# EAGLE schematic v1 (EAGLE 7.7.0)
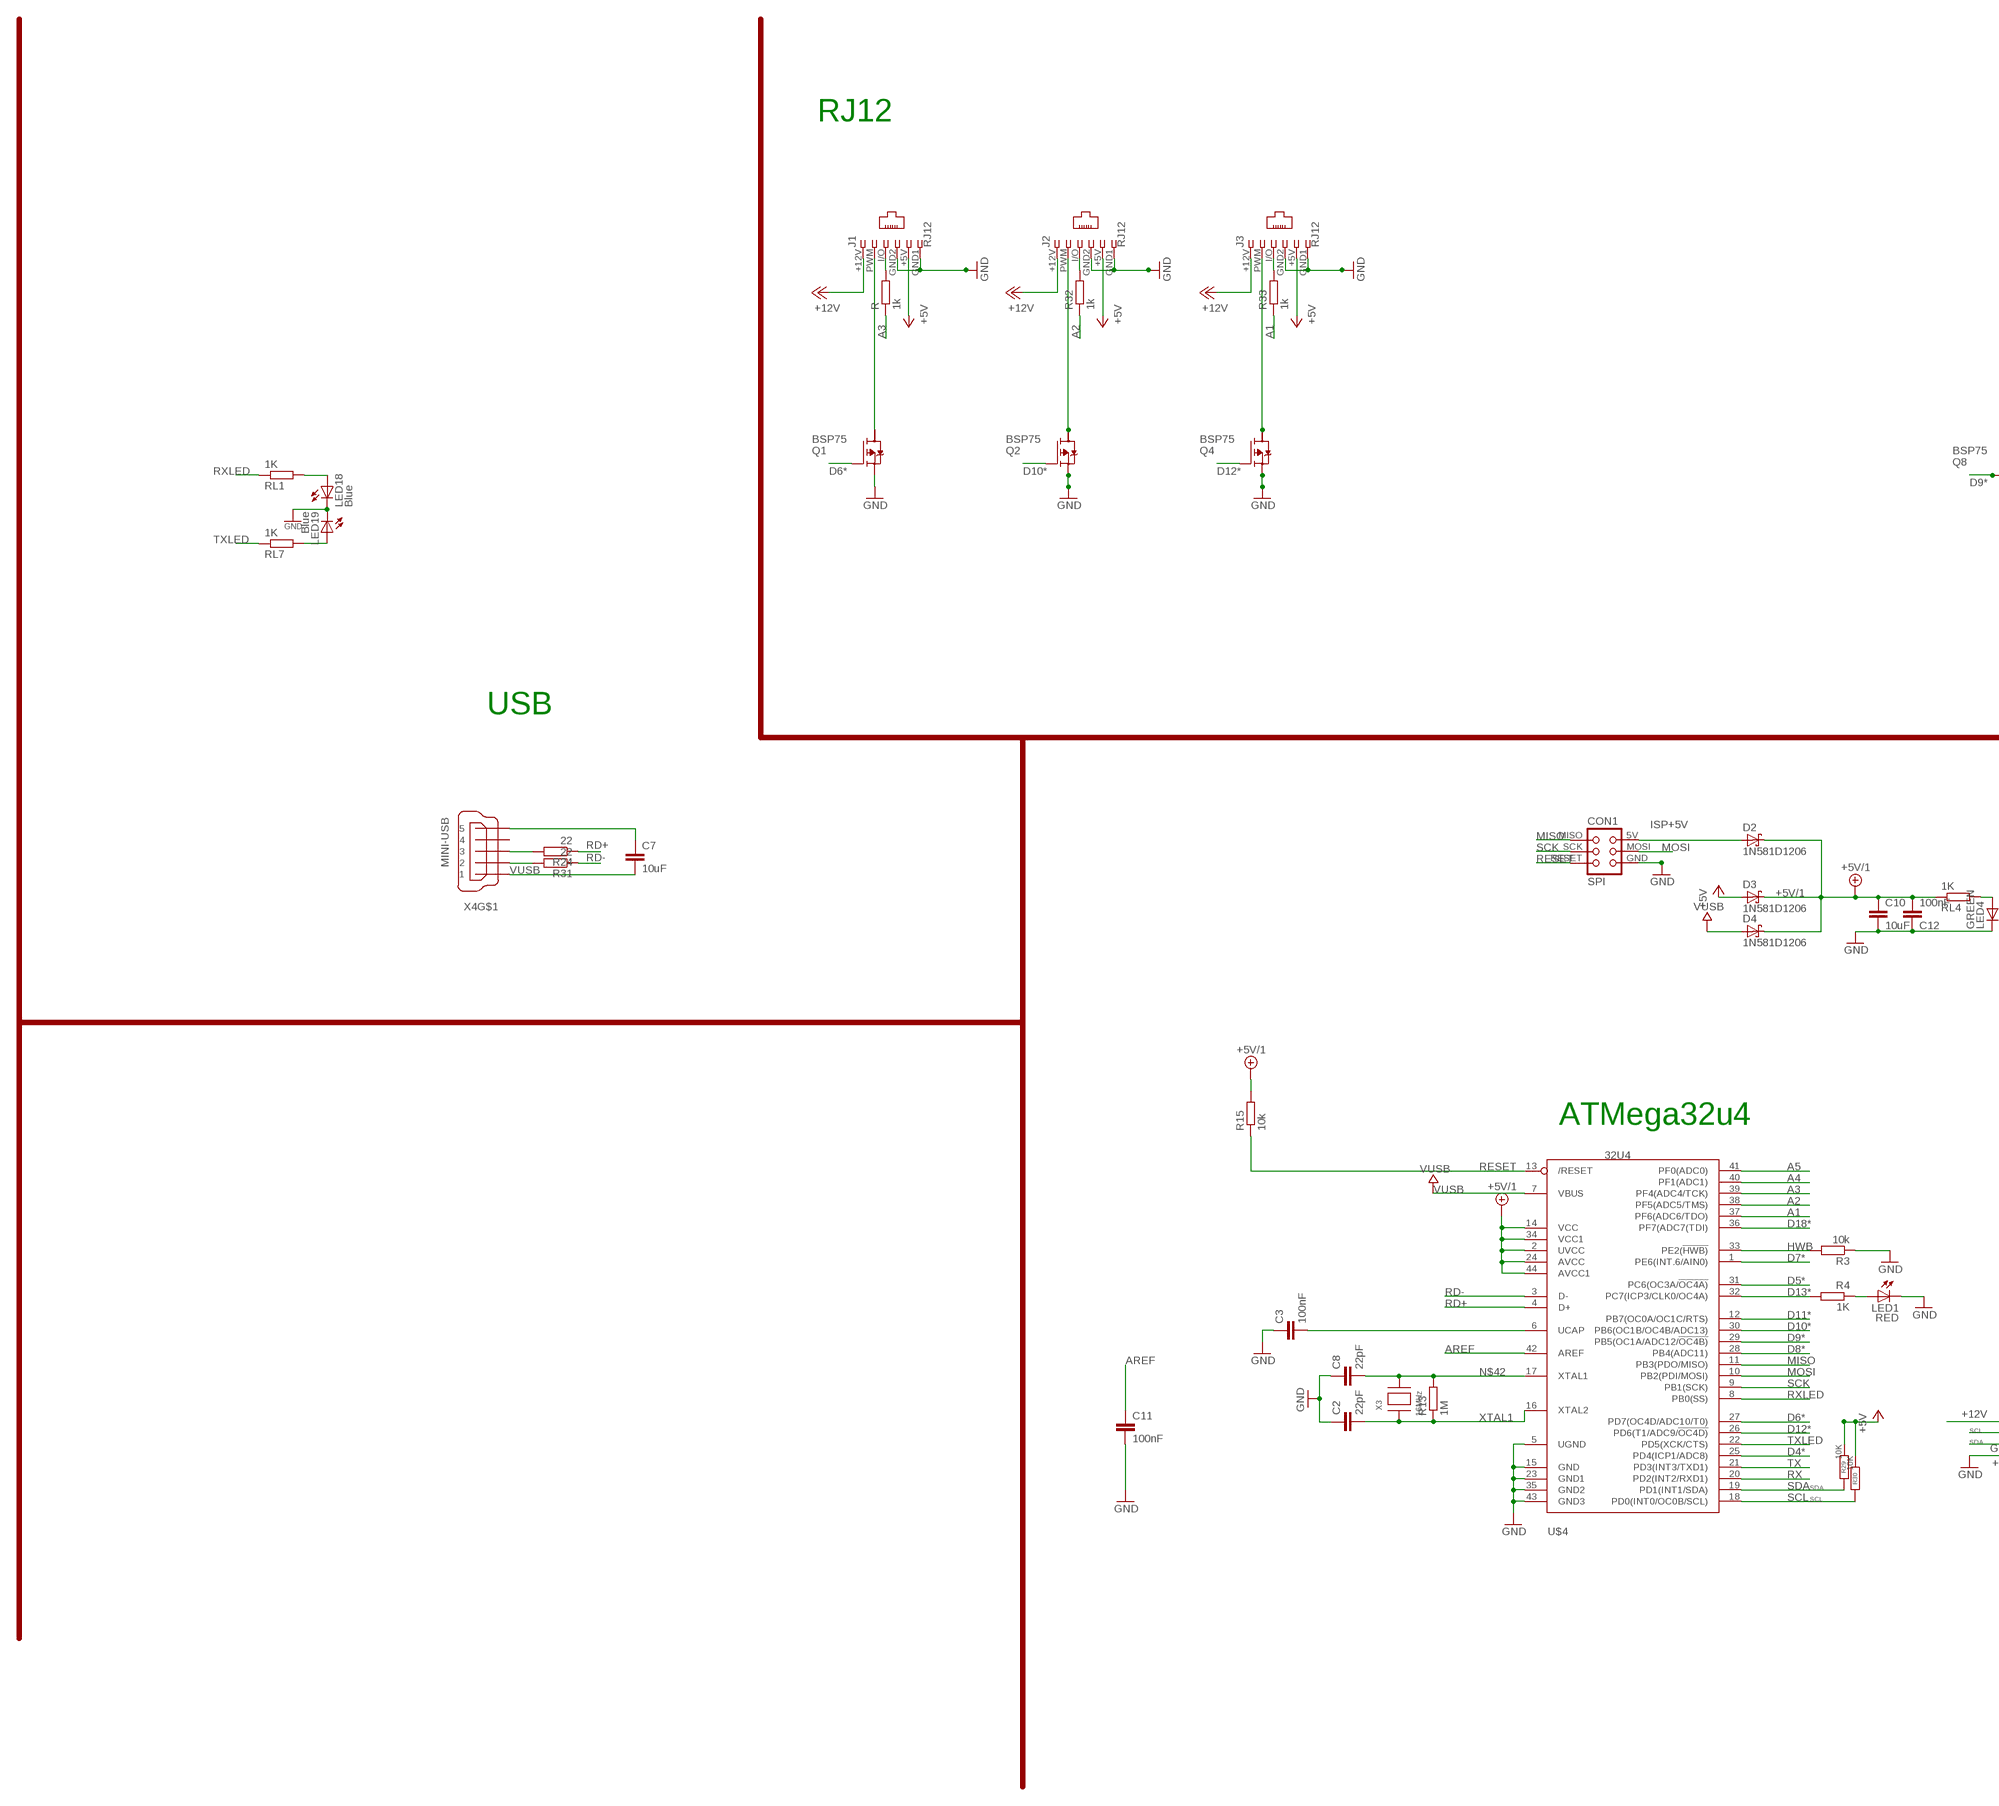
[diagram p0: schematic, sheet 1, part 1 of 2]
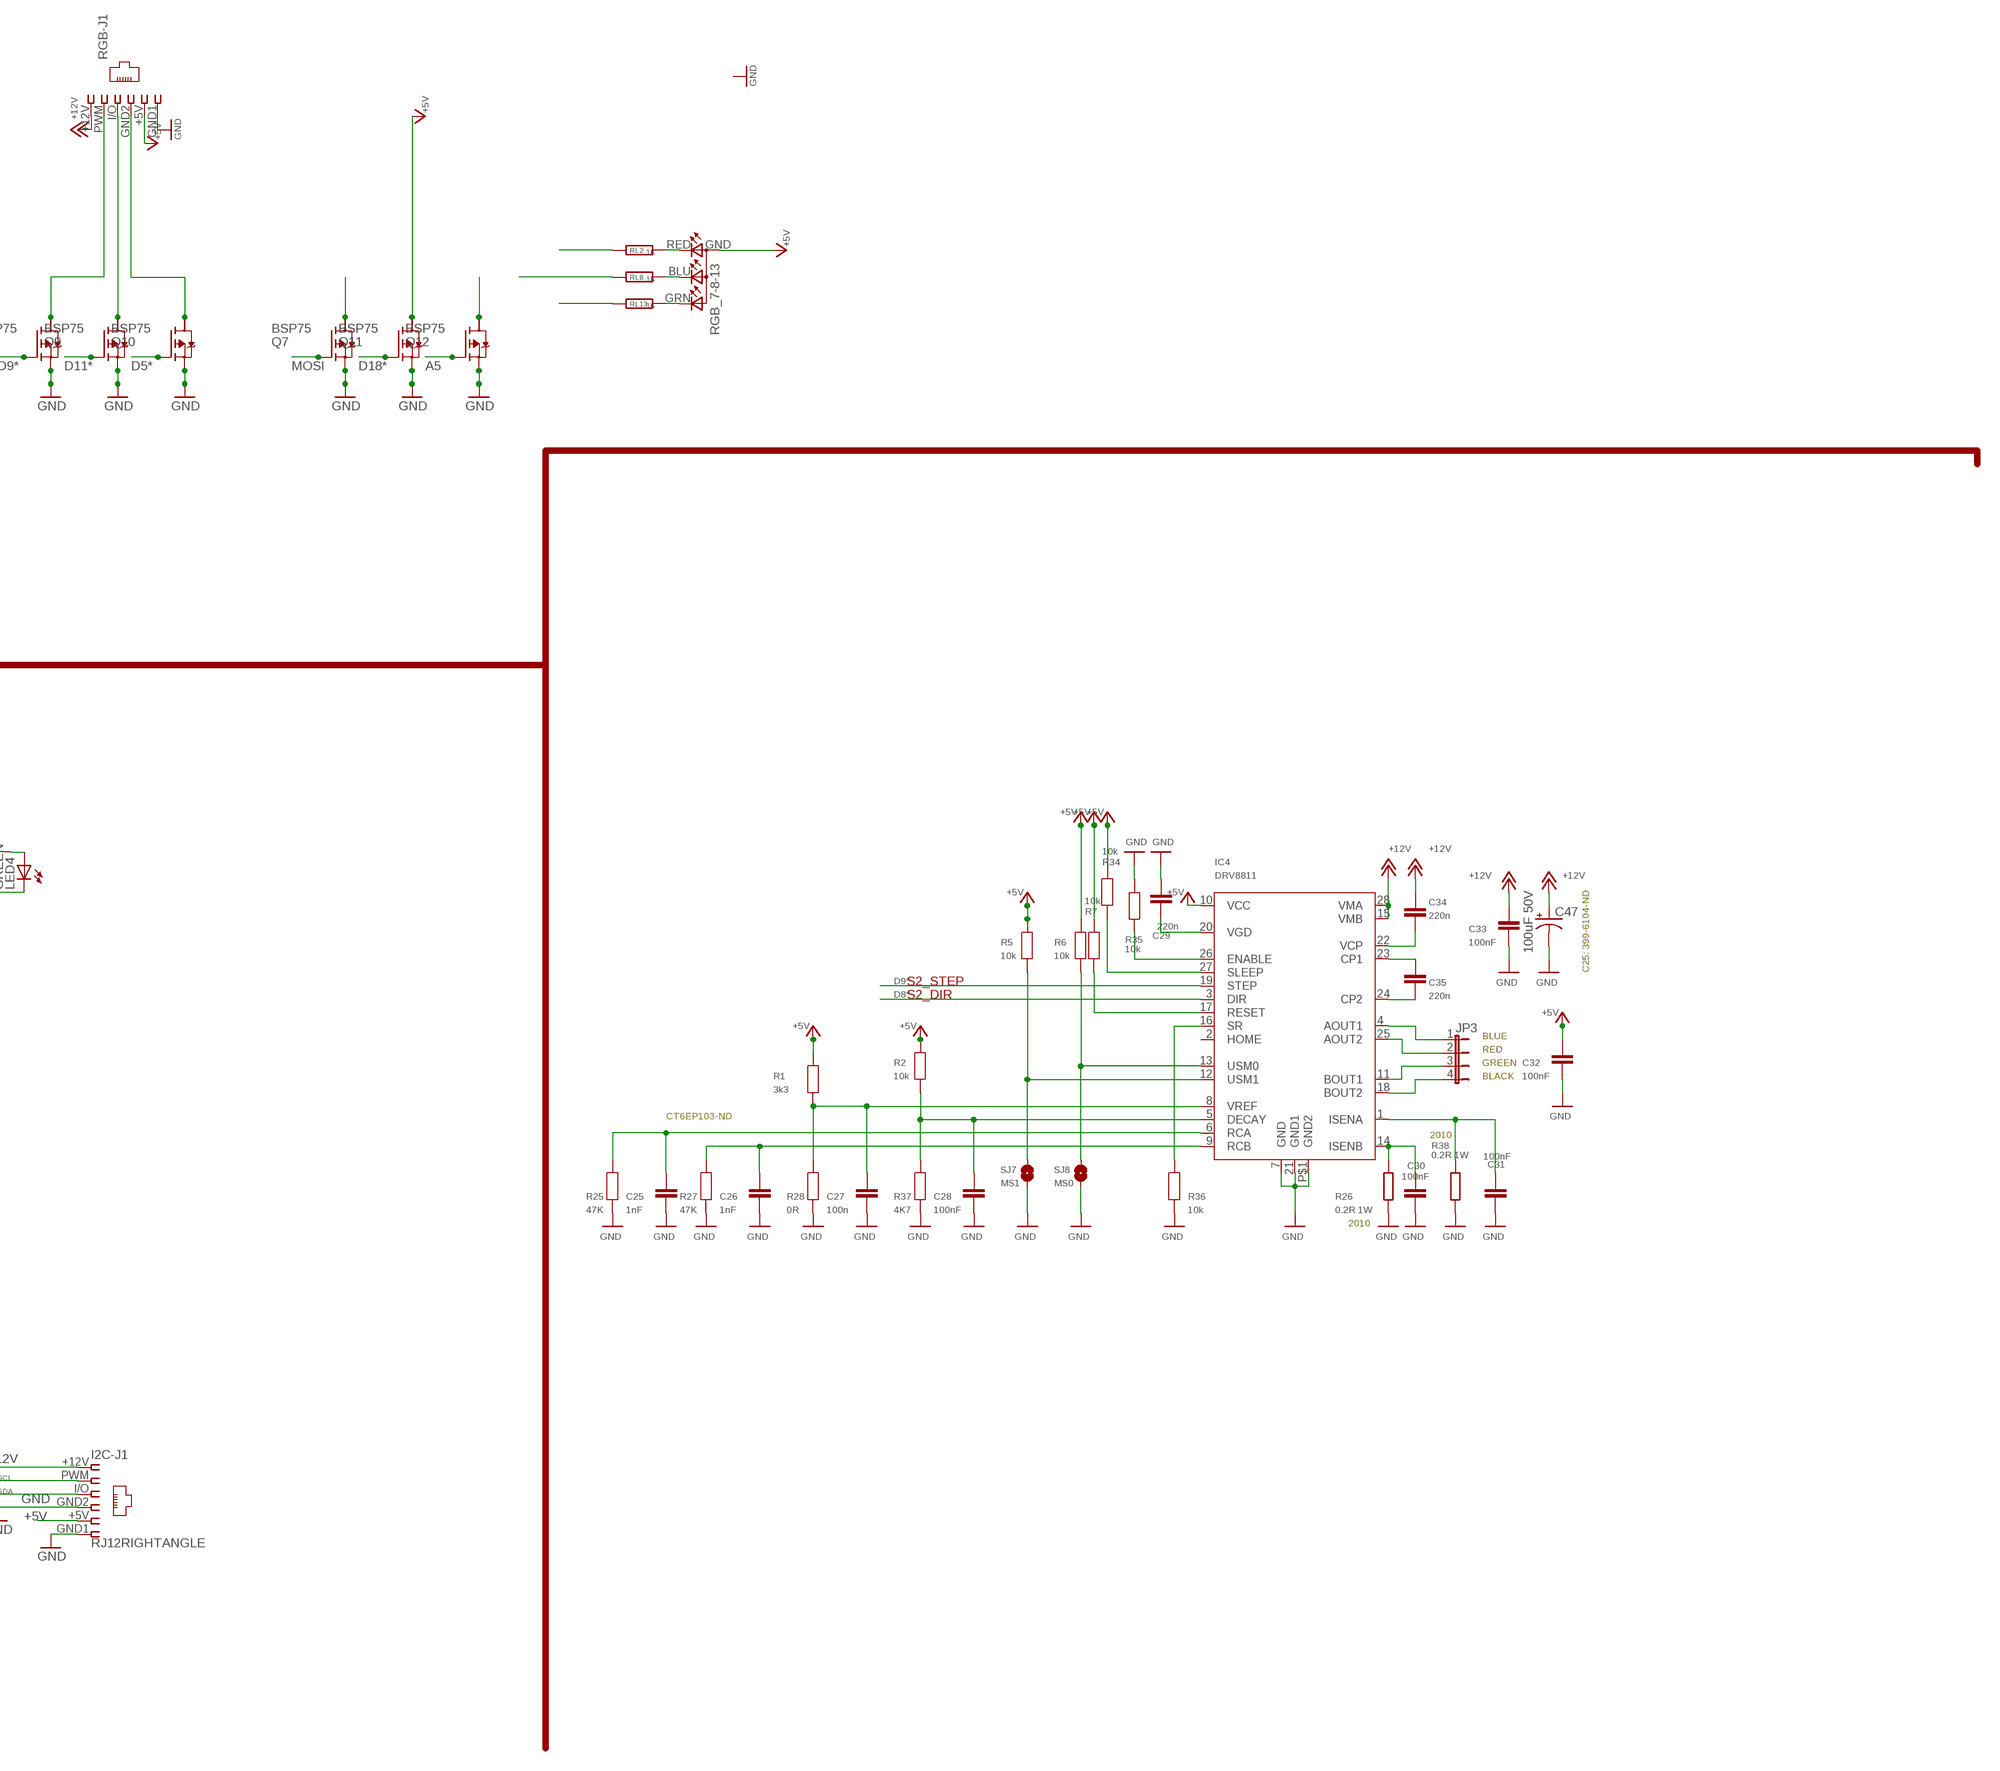
[diagram p1: schematic, sheet 1, part 2 of 2]

## Parts
C2  22pF  C-EUC1206  [C1206]
C3  100nF  C-EUC1206  [C1206]
C7  10uF  C-EUC1206  [C1206]
C8  22pF  C-EUC1206  [C1206]
C10  10uF  C-EUC1206  [C1206]
C11  100nF  C-EUC1206  [C1206]
C12  100nF  C-EUC1206  [C1206]
C25  1nF  CAP0805  [0805]
C26  1nF  CAP0805  [0805]
C27  100n  CAP0805  [0805]
C28  100nF  CAP0805  [0805]
C29  220n  CAP0805  [0805]
C30  100nF  CAP0603  [0603]
C31  100nF  CAP0805  [0805]
C32  100nF  CAP0805  [0805]
C33  100nF  CAP0805  [0805]
C34  220n  CAP0805  [0805]
C35  220n  CAP0805  [0805]
C47  100uF 50V  CAP_POLE  [PANASONIC_E]
CON1  SPI  TINYISPT  [TC2030-MCP-NL]
D2  1N581D1206  [LED-1206]
D3  1N581D1206  [LED-1206]
D4  1N581D1206  [LED-1206]
I2C-J1  RJ12RIGHTANGLE  [RJ12-RIGHTANGLE]
IC4  DRV8811  [HTSSOP28]
J1  RJ12  RJ12RIGHTANGLE  [RJ12-RIGHTANGLE]
J2  RJ12  RJ12RIGHTANGLE  [RJ12-RIGHTANGLE]
J3  RJ12  RJ12RIGHTANGLE  [RJ12-RIGHTANGLE]
JP3  JP4E  [JP4]
LED1  RED  LEDCHIP-LED0805  [CHIP-LED0805]
LED4  GREEN  LEDCHIP-LED0805  [CHIP-LED0805]
LED18  Blue  LEDCHIP-LED0805  [CHIP-LED0805]
LED19  Blue  LEDCHIP-LED0805  [CHIP-LED0805]
Q1  BSP75  BSP613P  [PG-SOT-223]
Q2  BSP75  BSP613P  [PG-SOT-223]
Q4  BSP75  BSP613P  [PG-SOT-223]
Q7  BSP75  BSP613P  [PG-SOT-223]
Q8  BSP75  BSP613P  [PG-SOT-223]
Q9  BSP75  BSP613P  [PG-SOT-223]
Q10  BSP75  BSP613P  [PG-SOT-223]
Q11  BSP75  BSP613P  [PG-SOT-223]
Q12  BSP75  BSP613P  [PG-SOT-223]
R  1k  R-EU_R0805  [R0805]
R1  3k3  RESISTOR0805  [0805]
R2  10k  RESISTOR0805  [0805]
R3  10k  R-EU_M0805  [M0805]
R4  1K  R-EU_R0805  [R0805]
R5  10k  RESISTOR0805  [0805]
R6  10k  RESISTOR0805  [0805]
R7  10k  RESISTOR0805  [0805]
R13  1M  R-EU_R1206  [R1206]
R15  10k  R-EU_M0805  [M0805]
R24  22  R-EU_M1206  [M1206]
R25  47K  RESISTOR0805  [0805]
R26  0.2R 1W  R-EU_R2010  [R2010]
R27  47K  RESISTOR0805  [0805]
R28  0R  RESISTOR0805  [0805]
R29  10K  R-EU_M0805  [M0805]
R30  10K  R-EU_M0805  [M0805]
R31  22  R-EU_M1206  [M1206]
R32  1k  R-EU_R0805  [R0805]
R33  1k  R-EU_R0805  [R0805]
R34  10k  RESISTOR0805  [0805]
R35  10k  RESISTOR0805  [0805]
R36  10k  RESISTOR0805  [0805]
R37  4K7  RESISTOR0805  [0805]
R38  0.2R 1W  R-EU_R2010  [R2010]
RGB-J1  RJ12  RJ12RIGHTANGLE  [RJ12-RIGHTANGLE]
RGB_7-8-13  TOPLED-3  [LED-TRICOLOR-THROUGHHOLE]
RL1  1K  R-EU_R0805  [R0805]
RL2  1K  R-EU_M1206  [M1206]
RL4  1K  R-EU_R0805  [R0805]
RL7  1K  R-EU_R0805  [R0805]
RL8  1K  R-EU_M1206  [M1206]
RL13  1K  R-EU_M1206  [M1206]
SJ7  MS1  SJ  [SJ]
SJ8  MS0  SJ  [SJ]
U$4  32U4  ATMEGA32U4-AU  [TQFP44]
X3  16MHz  XTALNX6035  [NX6035]
X4  MINI-USB  MINI-USB-SCHIELD-32005-201  [32005-201]

## Nets
+5V [power]: C32.1 D3.A I2C-J1.+5V IC4.10(VCC) J1.+5V J2.+5V J3.+5V Q11.2(D) R1.2 R2.2 R5.2 R6.2 R7.2 R29.1 R30.1 R34.2 RGB-J1.+5V
+5V1 [VIN]: RGB_7-8-13.GND(A2) ; supply symbol labelled +5V
+5V/1 [fine]: C10.1 C12.2 D2.C D3.C D4.C R15.2 RL4.1 U$4.2(UVCC) U$4.14(VCC) U$4.24(AVCC) U$4.34(VCC1) U$4.44(AVCC1)
+12V [power]: C33.1 C34.1 C47.+ I2C-J1.+12V IC4.15(VMB) IC4.28(VMA) J1.+12V J2.+12V J3.+12V RGB-J1.+12V
A1: R33.1 U$4.37(PF6(ADC6/TDO))
A2: R32.1 U$4.38(PF5(ADC5/TMS))
A3: R.1 U$4.39(PF4(ADC4/TCK))
A4: U$4.40(PF1(ADC1))
A5: Q12.1(G) U$4.41(PF0(ADC0))
AREF: C11.1 U$4.42(AREF)
D4*: U$4.25(PD4(ICP1/ADC8))
D5*: Q10.1(G) U$4.31(PC6(OC3A/!OC4A))
D6*: Q1.1(G) U$4.27(PD7(OC4D/ADC10/T0))
D7*: U$4.1(PE6(INT.6/AIN0))
D8*: IC4.3(DIR) U$4.28(PB4(ADC11))
D9*: IC4.19(STEP) Q8.1(G) U$4.29(PB5(OC1A/ADC12/!OC4B))
D10*: Q2.1(G) U$4.30(PB6(OC1B/OC4B/ADC13))
D11*: Q9.1(G) U$4.12(PB7(OC0A/OC1C/RTS))
D12*: Q4.1(G) U$4.26(PD6(T1/ADC9/!OC4D))
D13*: R4.2 U$4.32(PC7(ICP3/CLK0/OC4A))
D18*: Q11.1(G) U$4.36(PF7(ADC7(TDI))
D+USB: R24.2 X4.3
D-USB: R31.2 X4.2
GND [power]: C2.1 C3.1 C7.1 C8.1 C10.2 C11.2 C12.1 C25.2 C26.2 C27.2 C28.2 C29.2 C30.2 C31.2 C32.2 C33.2 C47.- CON1.GND I2C-J1.GND1 I2C-J1.GND2 IC4.7(GND) IC4.21(GND1) IC4.P$1(GND2) J1.GND1 J1.GND2 J2.GND1 J2.GND2 J3.GND1 J3.GND2 LED1.C LED4.C LED18.C LED19.C Q1.3(S) Q2.3(S) Q4.3(S) Q7.3(S) Q8.3(S) Q9.3(S) Q10.3(S) Q11.3(S) Q12.3(S) R3.1 R25.1 R26.1 R27.1 R28.1 R35.1 R36.1 R37.1 R38.1 RGB-J1.GND1 SJ7.1 SJ8.1 U$4.5(UGND) U$4.15(GND) U$4.23(GND1) U$4.35(GND2) U$4.43(GND3) X4.5
HWB: R3.2 U$4.33(PE2(!HWB))
ISP+5V: CON1.5V(VCC) D2.A
MISO: CON1.MISO U$4.11(PB3(PDO/MISO))
MOSI: CON1.MOSI Q7.1(G) U$4.10(PB2(PDI/MOSI))
N$1: J3.PWM Q4.2(D)
N$2: J2.I/O R32.2
N$3: IC4.18(BOUT2) JP3.4
N$4: LED1.A R4.1
N$5: IC4.25(AOUT2) JP3.2
N$6 [aref]: Q10.2(D) RGB-J1.GND2
N$7: J3.I/O R33.2
N$8: LED18.A RL1.2
N$9: C35.2 IC4.24(CP2)
N$11: IC4.26(ENABLE) R35.2
N$12: LED4.A RL4.2
N$14: LED19.A RL7.2
N$16: C3.2 U$4.6(UCAP)
N$18: J1.I/O R.2
N$19 [power]: RL8.1
N$20 [aref]: Q7.2(D)
N$21 [power]: RL13.1
N$22: RGB_7-8-13.RED(CRED) RL2.2
N$23 [aref]: Q12.2(D)
N$24: RGB_7-8-13.BLU(CBLUE) RL8.2
N$25: RGB_7-8-13.GRN(CGREEN) RL13.2
N$26 [power]: RL2.1
N$28: J2.PWM Q2.2(D)
N$29: C35.1 IC4.23(CP1)
N$30: C34.2 IC4.22(VCP)
N$34: J1.PWM Q1.2(D)
N$35: C29.1 IC4.20(VGD)
N$36: C31.1 IC4.1(ISENA) R38.2
N$40: C30.1 IC4.14(ISENB) R26.2
N$42: C8.2 R13.2 U$4.17(XTAL1) X3.P$2
N$44: C28.1 IC4.5(DECAY) R2.1 R37.2
N$45: C25.1 IC4.6(RCA) R25.2
N$46: C26.1 IC4.9(RCB) R27.2
N$47: IC4.27(SLEEP) R34.1
N$48: IC4.17(RESET) R7.1
N$49: C27.1 IC4.8(VREF) R1.1 R28.2
N$50 [aref]: Q9.2(D) RGB-J1.I/O
N$51: IC4.12(USM1) R5.1 SJ7.2
N$53: IC4.13(USM0) R6.1 SJ8.2
N$54: IC4.16(SR) R36.2
N$55: IC4.4(AOUT1) JP3.1
N$56: IC4.11(BOUT1) JP3.3
N$68 [aref]: Q8.2(D) RGB-J1.PWM
RD+: R24.1 U$4.4(D+)
RD-: R31.1 U$4.3(D-)
RESET: CON1.RESET R15.1 U$4.13(/RESET)
RX: U$4.20(PD2(INT2/RXD1))
RXLED: RL1.1 U$4.8(PB0(SS))
SCK: CON1.SCK U$4.9(PB1(SCK))
SCL: I2C-J1.PWM R30.2 U$4.18(PD0(INT0/OC0B/SCL))
SDA: I2C-J1.I/O R29.2 U$4.19(PD1(INT1/SDA))
TX: U$4.21(PD3(INT3/TXD1))
TXLED: RL7.1 U$4.22(PD5(XCK/CTS))
VUSB: C7.2 D4.A U$4.7(VBUS) X4.1
XTAL1: C2.2 R13.1 U$4.16(XTAL2) X3.P$1
Unconnected: IC4.2(HOME) Q1.4(D) Q2.4(D) Q4.4(D) Q7.4(D) Q8.4(D) Q9.4(D) Q10.4(D) Q11.4(D) Q12.4(D) X4.4 X4.M1(S:S1) X4.M2(S:S2) X4.M3(S:S3) X4.M4(S:S4)

## Notes on the sheet
- RJ12
- USB
- C25: 399-6104-ND
- S2_STEP
- S2_DIR
- BLUE
- RED
- GREEN
- BLACK
- ATMega32u4 | CT6EP103-ND
- 2010
- 2010

## Library data of the parts
C2 C3 C7 C8 C10-C12 = rcl:C-EU: CAPACITOR, European symbol
C25-C35 = freetronics-master-v1:CAP: Capacitor Standard 0603 ceramic capacitor, and 0.1" leaded capacitor.
C47 = freetronics-original:CAP_POL: Capacitor Polarized These are standard SMD and PTH capacitors. Normally 10uF, 47uF, and 100uF in electrolytic and tantalum varieties. Always verify the external diameter of the through hole cap, it varies with capacity, voltage, and manufacturer. The EIA devices should be standard.
CON1 = lpatiny:TINYISP: CONNECTOR
D2-D4 = lpatiny:1N581*: 1.0A SCHOTTKY BARRIER RECTIFIER Source: http://www.diodes.com/datasheets/ds23001.pdf
I2C-J1 J1-J3 RGB-J1 = lpatiny:RJ12: CORCOM Modular RJ Jacks No Shield Source: www.tycoelectronics.com .. ENG_DS_1654001_1099_RJ_L_0507.pdf
IC4 = eje-components:DRV8811
JP3 = jumper:JP4E: JUMPER
LED1 LED4 LED18 LED19 = adafruit:LED: LED OSRAM: - CHIPLED LG R971, LG N971, LY N971, LG Q971, LY Q971, LO R971, LY R971 LH N974, LH R974 LS Q976, LO Q976, LY Q976 LO Q996 - Hyper CHIPLED LW Q18S LB Q993, LB Q99A, LB R99A - SideLED LS A670, LO A670, LY A670, LG A670, LP A670 LB A673, LV A673, LT A673, LW A673 LH A674 LY A675 LS A676, LA A676, LO A676, LY A676, LW A676 LS A679, LY A679, LG A679 - Hyper Micro SIDELED® LS Y876, LA Y876, LO Y876, LY Y876 LT Y87S - SmartLED LW L88C, LW L88S LB L89C, LB L89S, LG L890 LS L89K, LO L89K, LY L89K LS L896, LA L896, LO L896, LY L896 - TOPLED LS T670, LO T670, LY T670, LG T670, LP T670 LSG T670, LSP T670, LSY T670, LOP T670, LYG T670 LG T671, LOG T671, LSG T671 LB T673, LV T673, LT T673, LW T673 LH T674 LS T676, LA T676, LO T676, LY T676, LB T676, LH T676, LSB T676, LW T676 LB T67C, LV T67C, LT T67C, LS T67K, LO T67K, LY T67K, LW E67C LS E67B, LA E67B, LO E67B, LY E67B, LB E67C, LV E67C, LT E67C LW T67C LS T679, LY T679, LG T679 LS T770, LO T770, LY T770, LG T770, LP T770 LB T773, LV T773, LT T773, LW T773 LH T774 LS E675, LA E675, LY E675, LS T675 LS T776, LA T776, LO T776, LY T776, LB T776 LHGB T686 LT T68C, LB T68C - Hyper Mini TOPLED® LB M676 - Mini TOPLED Santana® LG M470 LS M47K, LO M47K, LY M47K Source: http://www.osram.convergy.de/
Q1 Q2 Q4 Q7-Q12 = infineon:BSP613P: SIPMOS (R) Small-Signal-Transistor P-Channel (2 Drain) Source: http://www.infineon.com/dgdl/BSP613P_Rev2.4.pdf; OC_FARNELL: unknown; OC_NEWARK: unknown
R R4 R13 R26 R32 R33 R38 RL1 RL7 = rcl:R-EU_: RESISTOR, European symbol
R1 R2 R5-R7 R25 R27 R28 R34-R37 = freetronics-master-v1:RESISTOR: Resistor Basic schematic elements and footprints for 0603, 1206, and PTH 1/10th watt (small) resistors.
R3 R15 R24 R29-R31 RL2 RL4 RL8 RL13 = resistor:R-EU_: RESISTOR, European symbol
RGB_7-8-13 = lpatiny:TOPLED-3: OSRAM - Hyper Multi TOPLED® (RGB) LB E673, LV E673, LT E673 - Power TOPLED® Enhanced optical Power LED (HOP2000) LS E67B, LA E67B, LO E67B, LY E67B - Hyper Multi TOPLED® Enhanced optical Power LED (HOP2000 / ATON®) LATB T66B - Hyper Multi TOPLED® Hyper-Bright LED LATB T686 Source: http://www.osram.convergy.de/
SJ7 SJ8 = freetronics-luke:SJ: PCB "solder jumper". Note that there should nothing on the BOM corresponding to this "component".
U$4 = adafruit:ATMEGA32U4: http://www.ladyada.net/library/eagle
X3 = lpatiny:XTAL: Low cost SMT crystals, no capacitors included http://www.ladyada.net/library/eagle
X4 = con-cypressindustries:MINI-USB-SCHIELD-: MINI USB-B Conector Source: www.cypressindustries.com; OC_FARNELL: unknown; OC_NEWARK: unknown

## Net classes
0 default: width 0.203 mm, clearance 0.25 mm
1 power: width 0.203 mm, drill 0.305 mm, clearance 0.25 mm
2 VIN: width 0.457 mm
3 fine: width 0.406 mm
4 aref: width 0.406 mm